# Altium schematic sheet POWER.SchDoc (part 2 of 2)
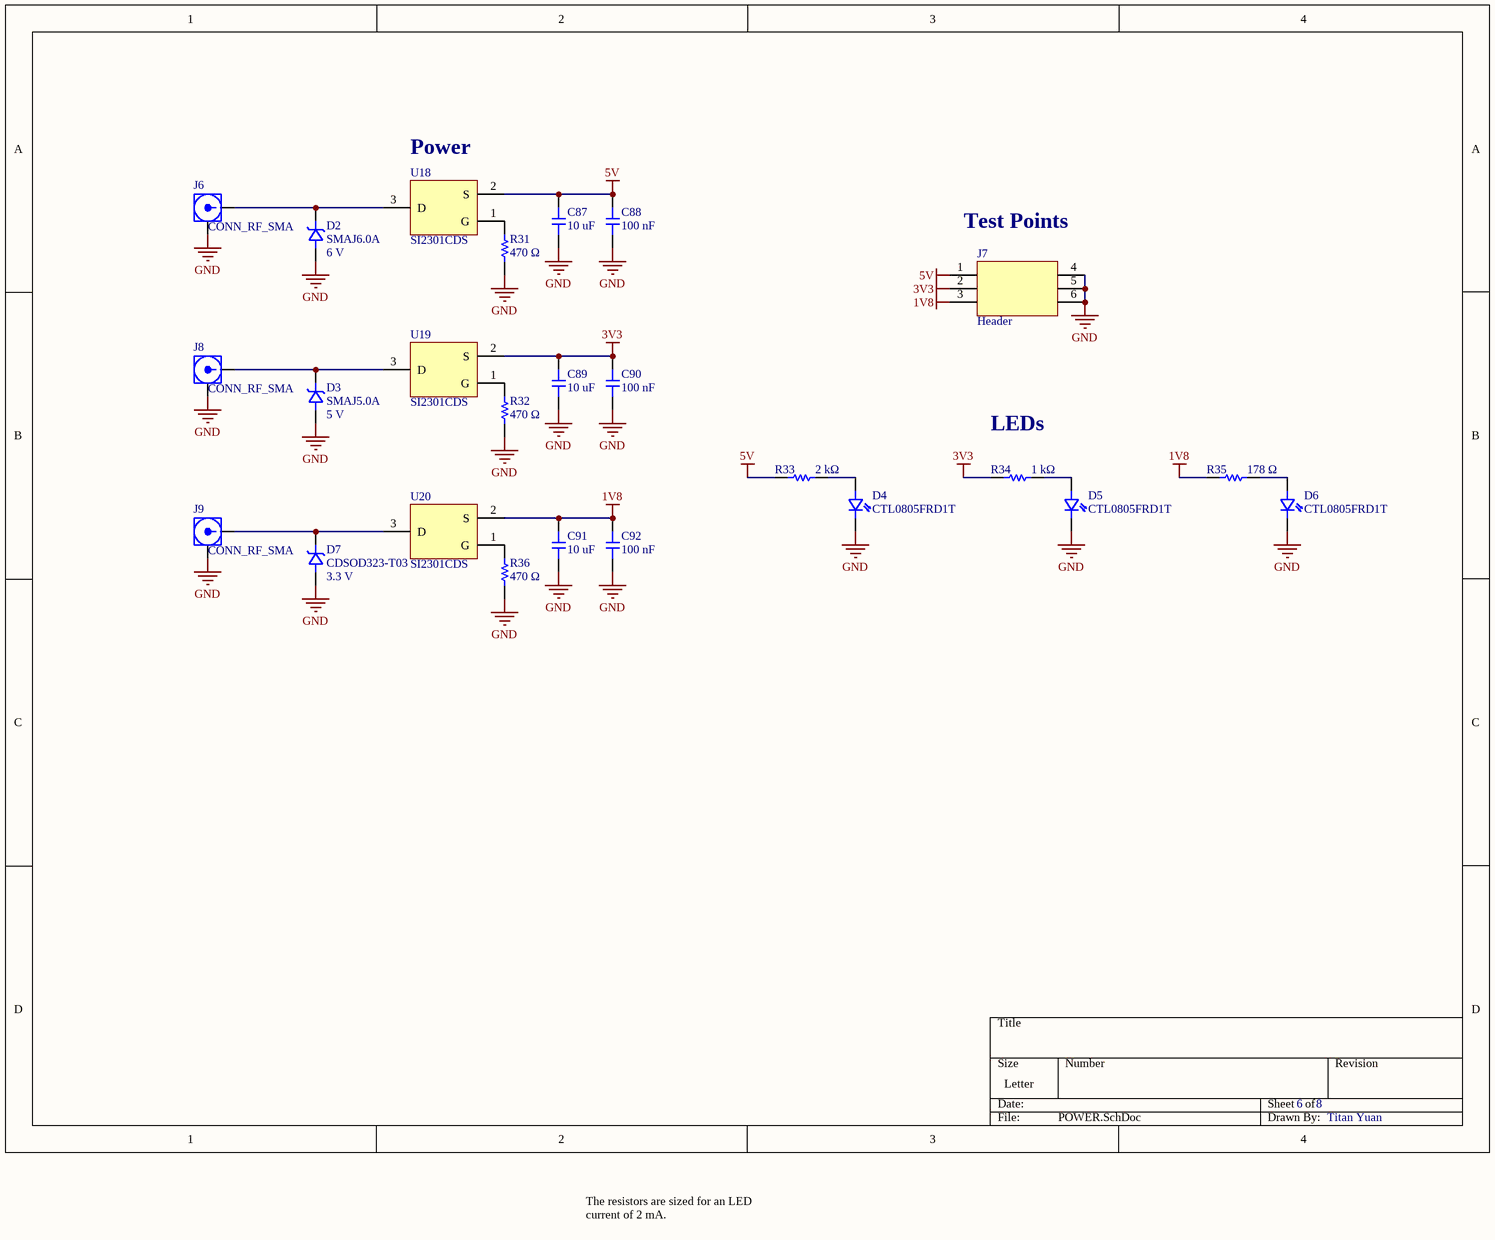
[diagram p1: POWER.SchDoc]

## Library data of the parts (continued)
R35 = RES: Res Thick Film 0603 178 Ohm 1% 0.1W(1/10W) ±100ppm/C Pad SMD T/R; Manufacturer: Yageo; Manufacturer Part Number: RC0603FR-07178RL; Power Dissipation: 100mW; Value: 178Ω; Temperature Coefficient: 100ppm/°C; Voltage Rating: 75V; Voltage Rating (DC): 50V; Tolerance: 1%; Power Rating: *; Package Size: 0603; Supplier: DigiKey; Supplier Part Number: 311-178HRCT-ND; RoHS: Compliant; Category: Chip SMD Resistors; Stock: 269039; Pricing: 1=0.1, 10=0.006, 25=0.0056, 50=0.0052 (USD); Case/Package: 0603; Case Code (Imperial): 0603; China RoHS: Non-Compliant; Composition: Thick Film; Depth: 800µm; Height: 450µm; Lead Free: Lead Free; Length: 1.6mm; Lifecycle Status: Production; Max Operating Temperature: 155°C; Military Standard: Not; Min Operating Temperature: -55°C; Mounting Technology: Surface Mount; Number of Terminals: 2; Packaging: Tape & Reel; REACH SVHC: Yes; Schedule B: 8533210045, 8533210045|8533210045|8533210045|8533210045|8533210045; Termination: SMD/SMT; Width: 800µm; Working Voltage: 75V; ComponentLink1URL: https://datasheet.octopart.com:443/RC0603FR-07178RL-Yageo-datasheet-175887523.pdf?src-supplier=Newark; ComponentLink1Description: https://datasheet.octopart.com:443/RC0603FR-07178RL-Yageo-datasheet-175887523.pdf?src-supplier=Newark; ComponentLink2URL: https://datasheet.octopart.com:443/RC0603FR-07178RL-Yageo-datasheet-103092701.pdf?src-supplier=Upverter; ComponentLink2Description: https://datasheet.octopart.com:443/RC0603FR-07178RL-Yageo-datasheet-103092701.pdf?src-supplier=Upverter; ComponentLink3URL: https://datasheet.octopart.com:443/RC0603FR-07178RL-Yageo-Group-datasheet-176638170.pdf?src-supplier=Future+Electronics; ComponentLink3Description: https://datasheet.octopart.com:443/RC0603FR-07178RL-Yageo-Group-datasheet-176638170.pdf?src-supplier=Future+Electronics; ComponentLink4URL: https://datasheet.octopart.com:443/RC0603FR-07178RL-Yageo-datasheet-164759695.pdf?src-supplier=Future+Electronics; ComponentLink4Description: https://datasheet.octopart.com:443/RC0603FR-07178RL-Yageo-datasheet-164759695.pdf?src-supplier=Future+Electronics; ComponentLink5URL: https://datasheet.octopart.com:443/RC0603FR-07178RL-Yageo-datasheet-137700087.pdf?src-supplier=Future+Electronics; ComponentLink5Description: https://datasheet.octopart.com:443/RC0603FR-07178RL-Yageo-datasheet-137700087.pdf?src-supplier=Future+Electronics; ComponentLink6URL: https://datasheet.octopart.com:443/RC0603FR-07178RL-Yageo-datasheet-101672632.pdf?src-supplier=Future+Electronics; ComponentLink6Description: https://datasheet.octopart.com:443/RC0603FR-07178RL-Yageo-datasheet-101672632.pdf?src-supplier=Future+Electronics; ComponentLink7URL: https://datasheet.octopart.com:443/RC0603FR-07178RL-Yageo-datasheet-15599030.pdf?src-supplier=Future+Electronics; ComponentLink7Description: https://datasheet.octopart.com:443/RC0603FR-07178RL-Yageo-datasheet-15599030.pdf?src-supplier=Future+Electronics; ComponentLink8URL: https://datasheet.octopart.com:443/RC0603FR-07178RL-Yageo-datasheet-12596169.pdf?src-supplier=Future+Electronics; ComponentLink8Description: https://datasheet.octopart.com:443/RC0603FR-07178RL-Yageo-datasheet-12596169.pdf?src-supplier=Future+Electronics; ComponentLink9URL: https://datasheet.octopart.com:443/RC0603FR-07178RL-Yageo-datasheet-8328172.pdf?src-supplier=Future+Electronics; ComponentLink9Description: https://datasheet.octopart.com:443/RC0603FR-07178RL-Yageo-datasheet-8328172.pdf?src-supplier=Future+Electronics; ComponentLink10URL: https://datasheet.octopart.com:443/RC0603FR-07178RL-Yageo-datasheet-148775077.pdf?src-supplier=TME; ComponentLink10Description: https://datasheet.octopart.com:443/RC0603FR-07178RL-Yageo-datasheet-148775077.pdf?src-supplier=TME; ComponentLink11URL: https://datasheet.octopart.com/RC0603FR-07178RL-Yageo-datasheet-73766026.pdf; ComponentLink11Description: https://datasheet.octopart.com/RC0603FR-07178RL-Yageo-datasheet-73766026.pdf; ComponentLink12URL: https://datasheet.octopart.com:443/RC0603FR-07178RL-Yageo-datasheet-118562.pdf?src-supplier=DigiKey; ComponentLink12Description: https://datasheet.octopart.com:443/RC0603FR-07178RL-Yageo-datasheet-118562.pdf?src-supplier=DigiKey; ComponentLink13URL: http://sigma.octopart.com:80/conflict_mineral_statement/Yageo-company-3.pdf?src-supplier=Compliance+Statements; ComponentLink13Description: http://sigma.octopart.com:80/conflict_mineral_statement/Yageo-company-3.pdf?src-supplier=Compliance+Statements; ComponentLink14URL: http://sigma.octopart.com:80/rohs_statement/Yageo-company-2.pdf?src-supplier=Compliance+Statements; ComponentLink14Description: http://sigma.octopart.com:80/rohs_statement/Yageo-company-2.pdf?src-supplier=Compliance+Statements
U18-U20 = SI2301CDS: P-ch Mosfet SOT-23 20V 112MOHM @ 4.5V - Lead(pb) And Halogen Free; Manufacturer: Vishay Siliconix; Manufacturer Part Number: SI2301CDS-T1-GE3; Continuous Drain Current (ID): 3.1A; Drain to Source Breakdown Voltage: -20V; Drain to Source Resistance: 112mΩ; Element Configuration: Single; Fall Time: 35ns; Gate to Source Voltage (Vgs): 8V; Input Capacitance: 405pF; Max Junction Temperature (Tj): 150°C; Max Power Dissipation: 1.6W; Nominal Vgs: -400mV; Number of Channels: 1; Value: 112mΩ; Threshold Voltage: -1V; Turn-Off Delay Time: 30ns; Turn-On Delay Time: 11ns; Supplier: DigiKey; Supplier Part Number: SI2301CDS-T1-GE3CT-ND; RoHS: Compliant; Category: MOSFETs; Stock: 103168; Pricing: 1=0.69, 10=0.425, 100=0.2731, 500=0.20736, 1000=0.18615, 3000=0.15917, 6000=0.14558, 9000=0.13865, 15000=0.13086, 21000=0.12625, 30000=0.12177, 75000=0.11875 (USD); Case/Package: SOT-23; China RoHS: Compliant; Contact Plating: Tin; Country of Origin: Mainland China; Drain to Source Voltage (Vdss): -20V; Export Control Classification Number (ECCN) Code: EAR99; Height: 1.12mm; Introduction Date: 2008-07-29; Lead Free: Lead Free; Length: 3.04mm; Lifecycle Status: NRND; Max Operating Temperature: 150°C; Min Breakdown Voltage: 20V; Min Operating Temperature: -55°C; Mounting Technology: Surface Mount; Number of Elements: 1; Pins: 3; Number of Terminals: 3; Packaging: Cut Tape; Power Dissipation: 1.6W; Radiation Hardening: No; Rds On Max: 112mΩ; REACH SVHC: Yes; Rise Time: 35ns; Schedule B: 8541210080, 8541210080|8541210080, 8541210080|8541210080|8541210080, 8541210080|8541210080|8541210080|8541210080; Weight: 1.437803g; Width: 1.4mm; ComponentLink1URL: https://datasheet.octopart.com:443/SI2301CDS-T1-GE3-Vishay-datasheet-181471154.pdf?src-supplier=Newark; ComponentLink1Description: https://datasheet.octopart.com:443/SI2301CDS-T1-GE3-Vishay-datasheet-181471154.pdf?src-supplier=Newark; ComponentLink2URL: https://datasheet.octopart.com:443/SI2301CDS-T1-GE3-Vishay-datasheet-12510940.pdf?src-supplier=Newark; ComponentLink2Description: https://datasheet.octopart.com:443/SI2301CDS-T1-GE3-Vishay-datasheet-12510940.pdf?src-supplier=Newark; ComponentLink3URL: https://datasheet.octopart.com:443/SI2301CDS-T1-GE3-Vishay-datasheet-8434571.pdf?src-supplier=Newark; ComponentLink3Description: https://datasheet.octopart.com:443/SI2301CDS-T1-GE3-Vishay-datasheet-8434571.pdf?src-supplier=Newark; ComponentLink4URL: https://datasheet.octopart.com:443/SI2301CDS-T1-GE3-Vishay-datasheet-41341312.pdf?src-supplier=Newark; ComponentLink4Description: https://datasheet.octopart.com:443/SI2301CDS-T1-GE3-Vishay-datasheet-41341312.pdf?src-supplier=Newark; ComponentLink5URL: https://datasheet.octopart.com:443/SI2301CDS-T1-GE3-Vishay-datasheet-62318581.pdf?src-supplier=element14+APAC; ComponentLink5Description: https://datasheet.octopart.com:443/SI2301CDS-T1-GE3-Vishay-datasheet-62318581.pdf?src-supplier=element14+APAC; ComponentLink6URL: https://datasheet.octopart.com:443/SI2301CDS-T1-GE3-Vishay-datasheet-41195220.pdf?src-supplier=element14+APAC; ComponentLink6Description: https://datasheet.octopart.com:443/SI2301CDS-T1-GE3-Vishay-datasheet-41195220.pdf?src-supplier=element14+APAC; ComponentLink7URL: https://datasheet.octopart.com:443/SI2301CDS-T1-GE3.-Vishay-datasheet-78863653.pdf?src-supplier=element14+APAC; ComponentLink7Description: https://datasheet.octopart.com:443/SI2301CDS-T1-GE3.-Vishay-datasheet-78863653.pdf?src-supplier=element14+APAC; ComponentLink8URL: https://datasheet.octopart.com:443/SI2301CDS-T1-GE3-Vishay-datasheet-21269440.pdf?src-supplier=Farnell; ComponentLink8Description: https://datasheet.octopart.com:443/SI2301CDS-T1-GE3-Vishay-datasheet-21269440.pdf?src-supplier=Farnell; ComponentLink9URL: https://datasheet.octopart.com:443/SI2301CDS-T1-GE3-Vishay-datasheet-165585106.pdf?src-supplier=TME; ComponentLink9Description: https://datasheet.octopart.com:443/SI2301CDS-T1-GE3-Vishay-datasheet-165585106.pdf?src-supplier=TME; ComponentLink10URL: https://datasheet.octopart.com:443/SI2301CDS-T1-GE3-Vishay-datasheet-44060305.pdf?src-supplier=TME; ComponentLink10Description: https://datasheet.octopart.com:443/SI2301CDS-T1-GE3-Vishay-datasheet-44060305.pdf?src-supplier=TME; ComponentLink11URL: https://datasheet.octopart.com:443/SI2301CDS-T1-GE3-Vishay-Siliconix-datasheet-62309529.pdf?src-supplier=RS+(Formerly+Allied+Electronics); ComponentLink11Description: https://datasheet.octopart.com:443/SI2301CDS-T1-GE3-Vishay-Siliconix-datasheet-62309529.pdf?src-supplier=RS+(Formerly+Allied+Electronics); ComponentLink12URL: https://datasheet.octopart.com:443/SI2301CDS-T1-GE3-Vishay-datasheet-14188513.pdf?src-supplier=iiiC; ComponentLink12Description: https://datasheet.octopart.com:443/SI2301CDS-T1-GE3-Vishay-datasheet-14188513.pdf?src-supplier=iiiC; ComponentLink13URL: http://sigma.octopart.com:80/rohs_statement/Vishay-company-15.pdf?src-supplier=Compliance+Statements; ComponentLink13Description: http://sigma.octopart.com:80/rohs_statement/Vishay-company-15.pdf?src-supplier=Compliance+Statements